# EAGLE schematic Galaksija keyboard connector (EAGLE 9.6.2)
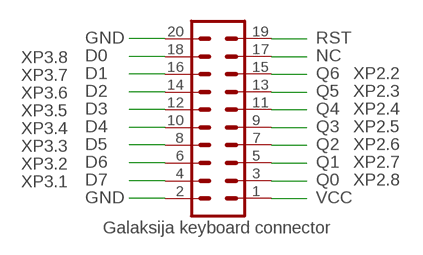
[diagram p0: schematic, sheet 1]

## Parts
SV1  Galaksija keyboard connector  ML20  [ML20]

## Nets
D0: SV1.18
D1: SV1.16
D2: SV1.14
D3: SV1.12
D4: SV1.10
D5: SV1.8
D6: SV1.6
D7: SV1.4
GND: SV1.2 SV1.20
NC: SV1.17
Q0: SV1.3
Q1: SV1.5
Q2: SV1.7
Q3: SV1.9
Q4: SV1.11
Q5: SV1.13
Q6: SV1.15
RST: SV1.19
VCC: SV1.1

## Notes on the sheet
- XP3.8
- XP3.7 | XP2.2
- XP3.6 | XP2.3
- XP3.5 | XP2.4
- XP3.4 | XP2.5
- XP3.3 | XP2.6
- XP3.2 | XP2.7
- XP3.1 | XP2.8

## Library data of the parts
SV1 = con-harting-ml:ML20: HARTING; OC_FARNELL: unknown; OC_NEWARK: unknown